# EAGLE design sendai (EAGLE 9.0.1)
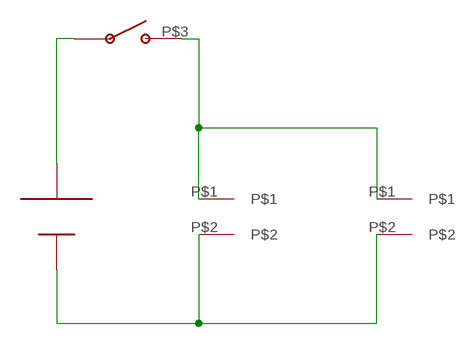
[diagram p0: schematic, sheet 1]

## Parts
U$1  CR2032  [CR2032]
U$2  CON2  [CON2]
U$3  CON2  [CON2]
U$4  LEAD_SWITCH  [LEAD_SWITCH]

## Nets
N$1: U$2.P$1 U$3.P$1 U$4.P$3
N$2: U$1.-1(-) U$2.P$2 U$3.P$2
N$3: U$1.+1(+) U$4.P$4

## Library data of the parts
U$1 = CR2032:CR2032
U$2 U$3 = CONNECTER:CON2
U$4 = LEAD_SWITCH:LEAD_SWITCH

## Board
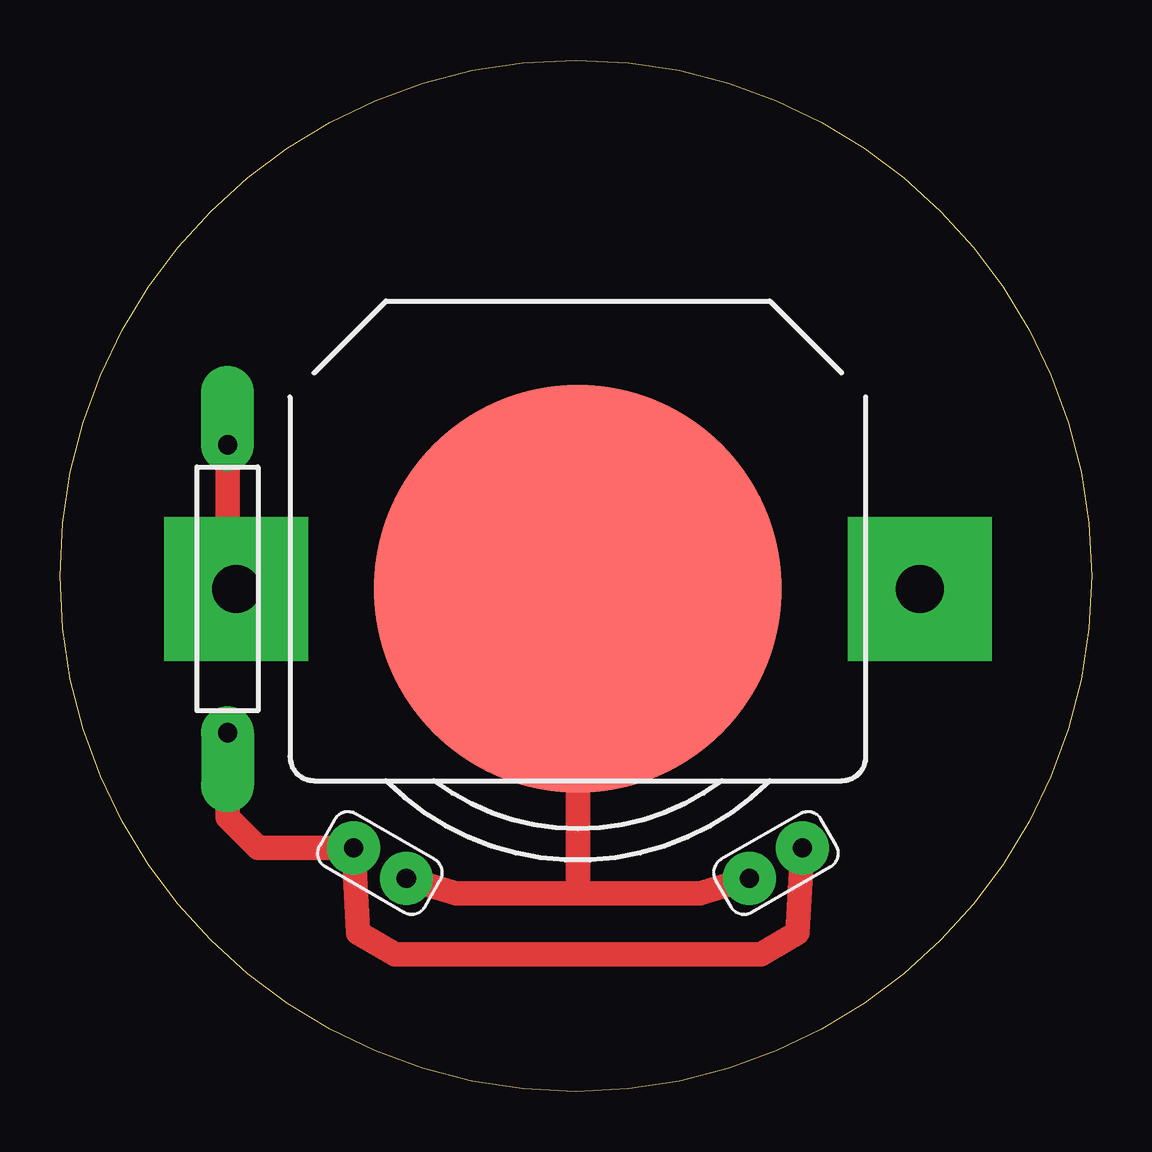
[diagram p1: board, top side]

Size 43 x 43 mm. Coordinates in mm from the lower left corner, seen from the top.
Outline: 43,21.5 42.89,19.3 42.56,17.17 42.03,15.11 41.31,13.13 40.41,11.25 39.33,9.48 38.09,7.82 36.7,6.3 35.18,4.91 33.52,3.67 31.75,2.6 29.87,1.69 27.89,0.97 25.83,0.44 23.7,0.11 21.5,0 19.3,0.11 17.17,0.44 15.11,0.97 13.13,1.69 11.25,2.6 9.48,3.67 7.82,4.91 6.3,6.3 4.91,7.82 3.67,9.48 2.6,11.25 1.69,13.13 0.97,15.11 0.44,17.17 0.11,19.3 0,21.5 0.11,23.7 0.44,25.83 0.97,27.89 1.69,29.87 2.6,31.75 3.67,33.52 4.91,35.18 6.3,36.7 7.82,38.09 9.48,39.33 11.25,40.41 13.13,41.31 15.11,42.03 17.17,42.56 19.3,42.89 21.5,43 23.7,42.89 25.83,42.56 27.89,42.03 29.87,41.31 31.75,40.41 33.52,39.33 35.18,38.09 36.7,36.7 38.09,35.18 39.33,33.52 40.41,31.75 41.31,29.87 42.03,27.89 42.56,25.83 42.89,23.7 43,21.5
Copper layers (1*16): Top 0.035mm / dielectric 1.5mm / Bottom 0.035mm
Design rules "default": minimum track width 6mil, minimum drill 0.35mm, track to track 6mil, track to pad 6mil, pad to pad 6mil, via to via 6mil, smd to smd 6mil, copper to edge 40mil, drill to drill 6mil, minimum pad ring 10mil, minimum via ring 8mil, stop-mask expansion 4mil, vias tented up to drill 0mil, thermal gap 10mil

### Footprints (pad centres in the part's own frame; a part is rotated, then mirrored left to right if it is on the bottom)
CR2032 = drill 2 pad 6 square: +1 -14.25,0; +2 14.25,0 | smd 17 x 17: -1 0,0
CON2 = drill 0.8 pad 2.2: P$1 -1.27,0; P$2 1.27,0
LEAD_SWITCH = drill 0.8 pad 2.2 offset: P$3 -6,0; P$4 6,0

### Placement (x,y rotation side)
U$1  21.59,20.95 0 top
U$2  13.34,9.53 330 top
U$3  29.84,9.53 210 top
U$4  6.99,20.95 90 top

### Tracks (layer width: path | path; a pad name or v marks a point on that pad's centre or on a via)
N$1
  Top 1.016: U$3.P$1 30.74,6.61 29.21,5.71 13.97,5.71 12.44,6.61 U$2.P$1 8.26,10.16 6.99,11.43 U$4.P$3
N$2
  Top 1.016: U$2.P$2 16.51,8.26 21.59,8.26 | U$3.P$2 26.67,8.26 21.59,8.26 | U$1.-1 21.59,8.26
N$3
  Top 1.016: U$4.P$4 6.99,21.31 U$1.+1